# EAGLE design untitled (EAGLE 7.2.0)
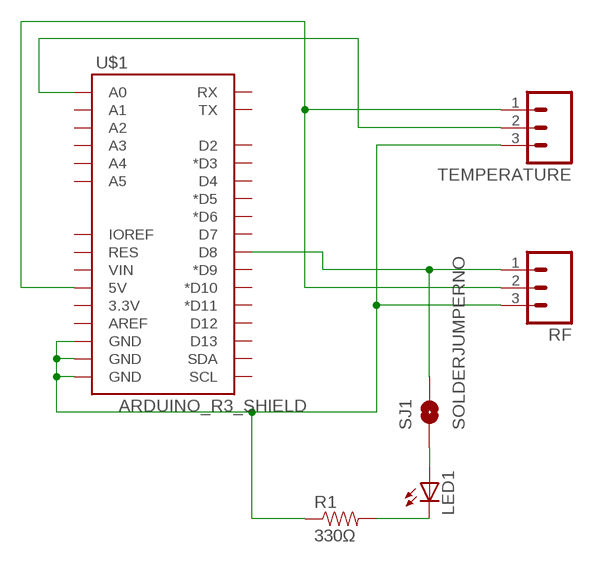
[diagram p0: schematic, sheet 1]

## Parts
LED1  LED5MM  [LED5MM]
R1  330Ω  10KOHM-1/4W-1%(PTH)HORIZ  [AXIAL-0.3]
RF  M03LONGPADS  [1X03_LONGPADS]
SJ1  SOLDERJUMPERNO  [SJ_2S-NO]
TEMPERATURE  M03LONGPADS  [1X03_LONGPADS]
U$1  ARDUINO_R3_SHIELD  [UNO_R3_SHIELD]

## Nets
N$2: LED1.A SJ1.1
N$3: R1.P$1 RF.3 TEMPERATURE.3 U$1.GND@0(GND) U$1.GND@1(GND) U$1.GND@2(GND)
N$4: RF.1 SJ1.2 U$1.D8
N$5: TEMPERATURE.2 U$1.A0
N$6: LED1.K(C) R1.P$2
N$7: RF.2 TEMPERATURE.1 U$1.5V
Unconnected: U$1.3.3V U$1.A1 U$1.A2 U$1.A3 U$1.A4 U$1.A5 U$1.AREF U$1.D2 U$1.D3(*D3) U$1.D4 U$1.D5(*D5) U$1.D6(*D6) U$1.D7 U$1.D9(*D9) U$1.D10(*D10) U$1.D11(*D11) U$1.D12 U$1.D13 U$1.IOREF U$1.RES U$1.RX U$1.SCL U$1.SDA U$1.TX U$1.VIN

## Library data of the parts
LED1 = adafruit:LED: LED OSRAM: - CHIPLED LG R971, LG N971, LY N971, LG Q971, LY Q971, LO R971, LY R971 LH N974, LH R974 LS Q976, LO Q976, LY Q976 LO Q996 - Hyper CHIPLED LW Q18S LB Q993, LB Q99A, LB R99A - SideLED LS A670, LO A670, LY A670, LG A670, LP A670 LB A673, LV A673, LT A673, LW A673 LH A674 LY A675 LS A676, LA A676, LO A676, LY A676, LW A676 LS A679, LY A679, LG A679 - Hyper Micro SIDELED® LS Y876, LA Y876, LO Y876, LY Y876 LT Y87S - SmartLED LW L88C, LW L88S LB L89C, LB L89S, LG L890 LS L89K, LO L89K, LY L89K LS L896, LA L896, LO L896, LY L896 - TOPLED LS T670, LO T670, LY T670, LG T670, LP T670 LSG T670, LSP T670, LSY T670, LOP T670, LYG T670 LG T671, LOG T671, LSG T671 LB T673, LV T673, LT T673, LW T673 LH T674 LS T676, LA T676, LO T676, LY T676, LB T676, LH T676, LSB T676, LW T676 LB T67C, LV T67C, LT T67C, LS T67K, LO T67K, LY T67K, LW E67C LS E67B, LA E67B, LO E67B, LY E67B, LB E67C, LV E67C, LT E67C LW T67C LS T679, LY T679, LG T679 LS T770, LO T770, LY T770, LG T770, LP T770 LB T773, LV T773, LT T773, LW T773 LH T774 LS E675, LA E675, LY E675, LS T675 LS T776, LA T776, LO T776, LY T776, LB T776 LHGB T686 LT T68C, LB T68C - Hyper Mini TOPLED® LB M676 - Mini TOPLED Santana® LG M470 LS M47K, LO M47K, LY M47K Source: http://www.osram.convergy.de/
R1 = SparkFun-Resistors:10KOHM-1/4W-1%(PTH): RES-12183; PROD_ID: RES-12183; VALUE: 10k
RF TEMPERATURE = SparkFun-Connectors:M03: Header 3 Standard 3-pin 0.1" header. Use with straight break away headers (SKU : PRT-00116), right angle break away headers (PRT-00553), swiss pins (PRT-00743), machine pins (PRT-00117), and female headers (PRT-00115). Molex polarized connector foot print use with SKU : PRT-08232 with associated crimp pins and housings.
SJ1 = SparkFun-Retired:SOLDERJUMPER: Solder Jumper Standard SMD solder jumper. Used to automate production. Two varients : Normally Open and Normally Closed are the same, but have different paste layers. NC will have a large amount of paste and should jumper during reflow.
U$1 = SparkFun-Boards:ARDUINO_R3_SHIELD: Shield form compatible with the Arduino Uno R3.

## Board
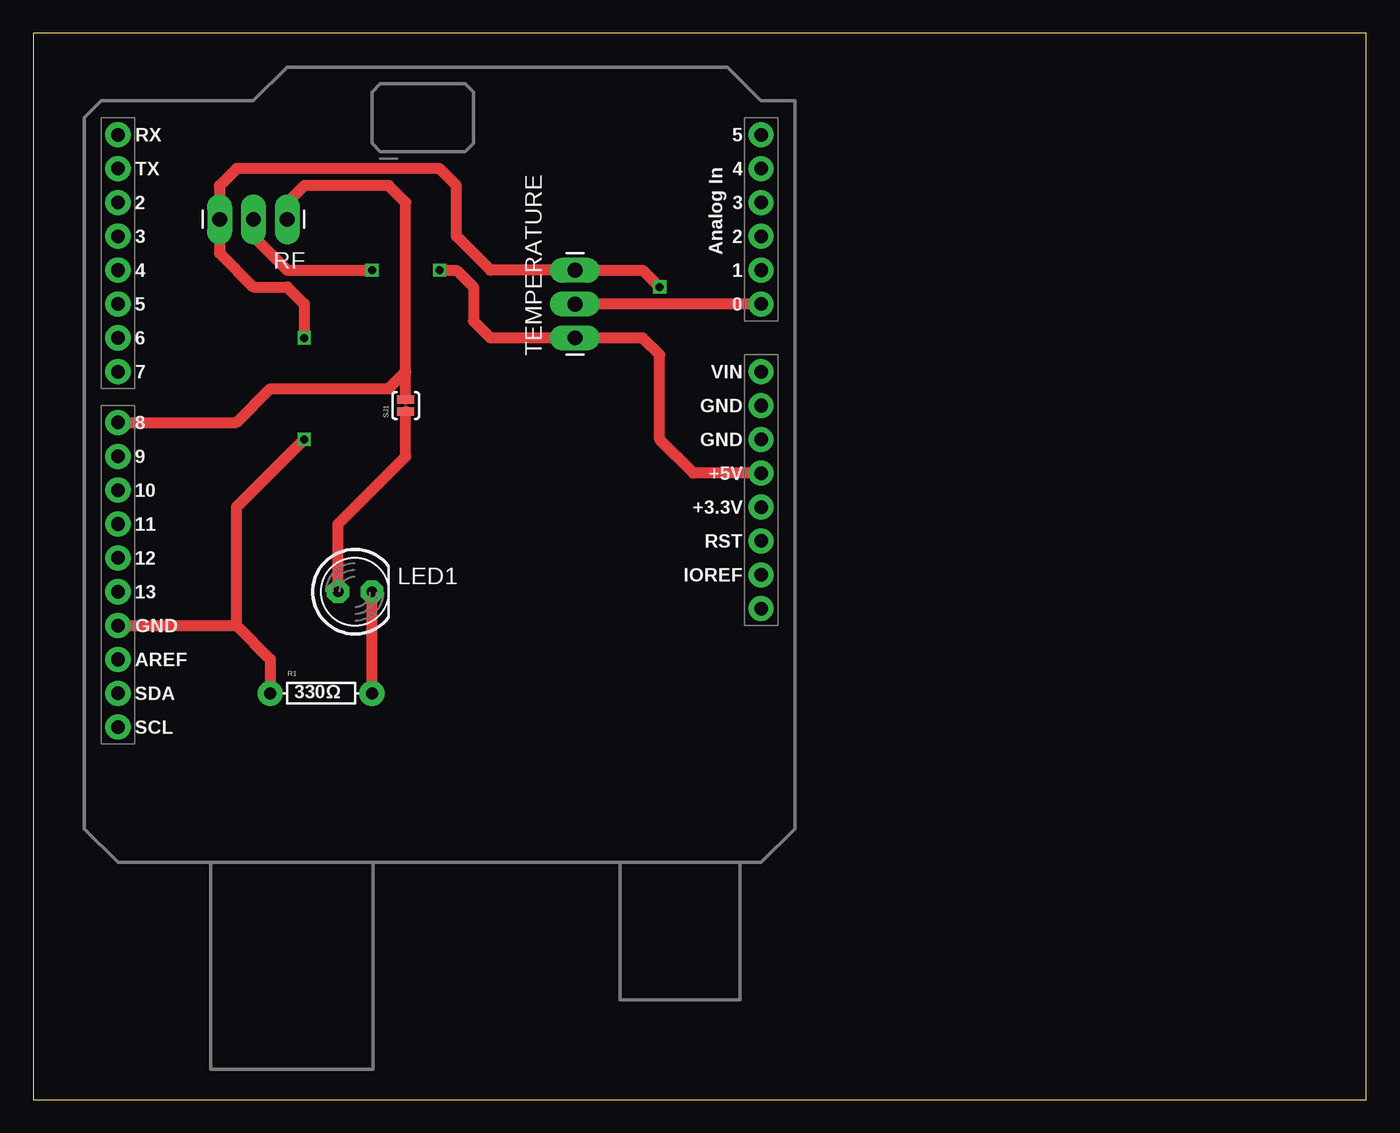
[diagram p1: board, top side]
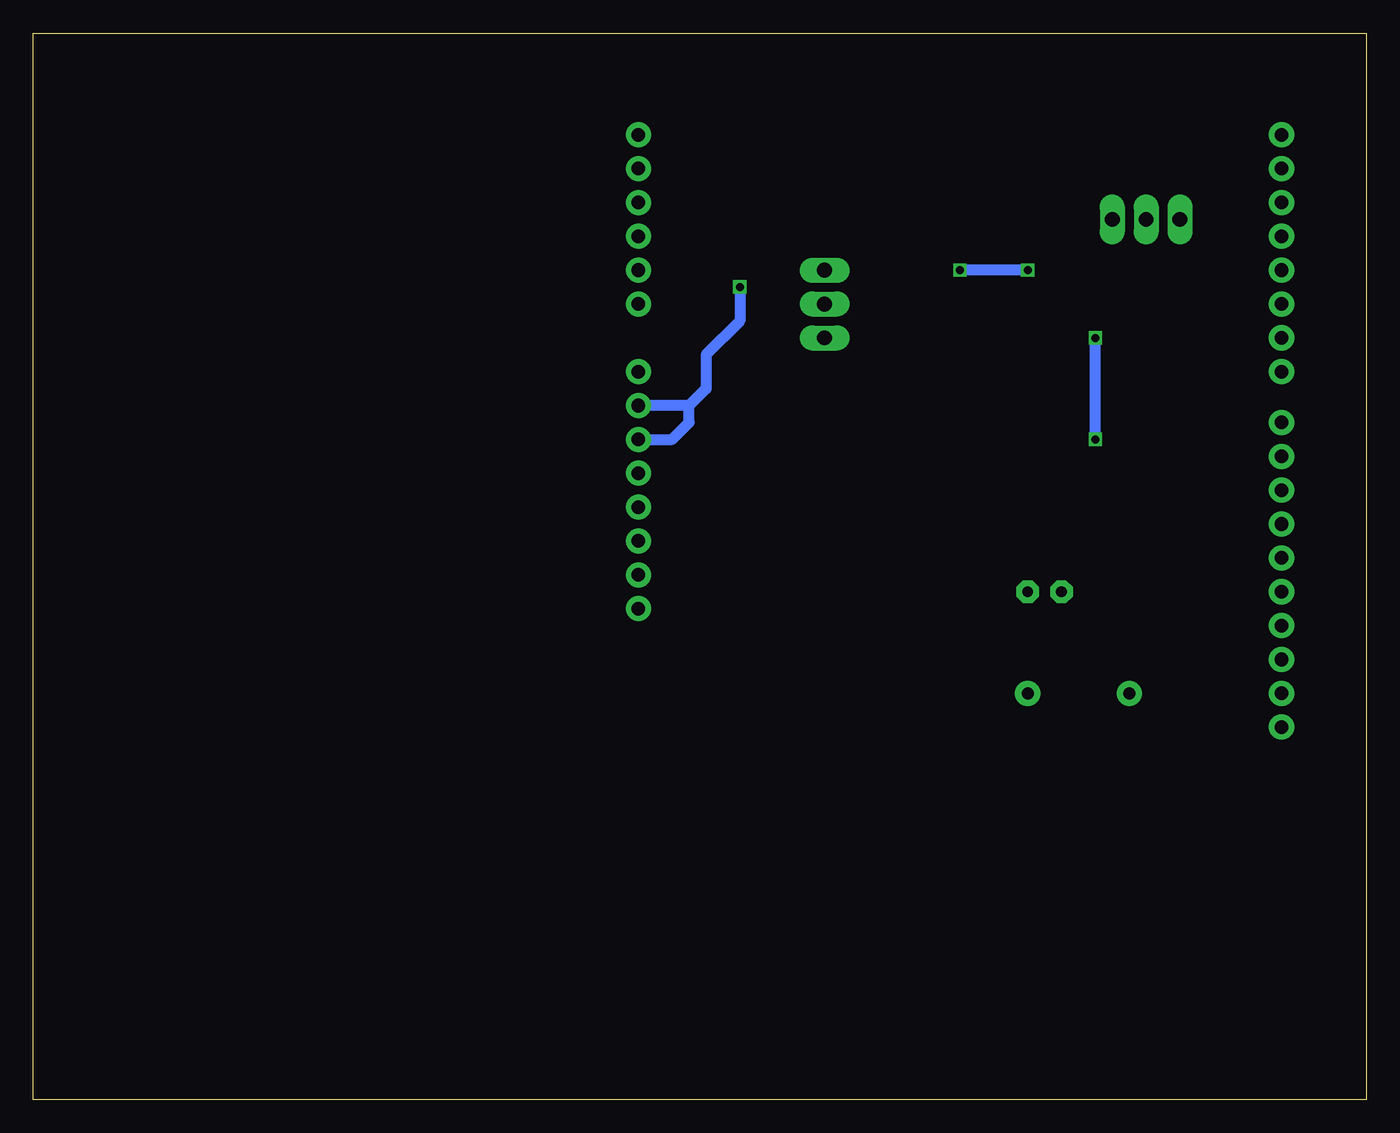
[diagram p2: board, bottom side, seen from below]

Size 100 x 80 mm. Coordinates in mm from the lower left corner, seen from the top.
Outline: 0,0 100,0 100,80 0,80 0,0
Copper layers (1*16): Top 0.035mm / dielectric 1.5mm / Bottom 0.035mm
Design rules "default": minimum track width 10mil, minimum drill 24mil, track to track 8mil, track to pad 8mil, pad to pad 8mil, via to via 8mil, smd to smd 8mil, copper to edge 40mil, drill to drill 8mil, minimum pad ring 10mil, minimum via ring 8mil, stop-mask expansion 4mil, vias tented up to drill 0mil, thermal gap 10mil

### Footprints (pad centres in the part's own frame; a part is rotated, then mirrored left to right if it is on the bottom)
LED5MM = drill 0.813 pad 1.676 octagon: A -1.27,0; K 1.27,0
AXIAL-0.3 = drill 0.9 pad 1.88: P$1 -3.81,0; P$2 3.81,0
1X03_LONGPADS = drill 1.118 pad 1.88 long: 1 0,0; 2 2.54,0; 3 5.08,0
SJ_2S-NO = smd 0.635 x 1.27: 1 -0.45,0; 2 0.45,0
UNO_R3_SHIELD = drill 1.016 pad 1.88: 3.3V 50.8,26.67; 5V 50.8,29.21; A0 50.8,41.91; A1 50.8,44.45; A2 50.8,46.99; A3 50.8,49.53; A4 50.8,52.07; A5 50.8,54.61; AREF 2.54,15.24; D2 2.54,49.53; D3 2.54,46.99; D4 2.54,44.45; D5 2.54,41.91; D6 2.54,39.37; D7 2.54,36.83; D8 2.54,33.02; D9 2.54,30.48; D10 2.54,27.94; D11 2.54,25.4; D12 2.54,22.86; D13 2.54,20.32; GND@0 50.8,31.75; GND@1 50.8,34.29; GND@2 2.54,17.78; IOREF 50.8,21.59; NC 50.8,19.05; RES 50.8,24.13; RX 2.54,54.61; SCL 2.54,10.16; SDA 2.54,12.7; TX 2.54,52.07; VIN 50.8,36.83

### Placement (x,y rotation side)
LED1  24.13,38.1 0 top
R1  21.59,30.48 0 top
RF  19.05,66.04 180 top
SJ1  27.94,52.07 90 top
TEMPERATURE  40.64,57.15 90 top
U$1  3.81,17.78 0 top

### Tracks (layer width: path | path; a pad name or v marks a point on that pad's centre or on a via)
N$2
  Top 0.813: LED1.A 22.86,43.18 27.94,48.26 SJ1.1
N$3  (via drill 0.6)
  Top 0.813: U$1.GND@2 15.24,35.56 | 15.24,35.56 17.78,33.02 R1.P$1 | v46.99,60.96 45.72,62.23 TEMPERATURE.3 34.29,62.23 31.75,64.77 31.75,68.58 30.48,69.85 15.24,69.85 13.97,68.58 RF.3 13.97,63.5 16.51,60.96 19.05,60.96 20.32,59.69 v20.32,57.15 | 15.24,35.56 15.24,44.45 v20.32,49.53
  Bottom 0.813: v46.99,60.96 46.99,58.42 49.53,55.88 49.53,53.34 50.8,52.07 | 50.8,52.07 U$1.GND@1 | U$1.GND@0 52.07,49.53 50.8,50.8 50.8,52.07 | v20.32,49.53 v20.32,57.15
N$4
  Top 0.813: SJ1.2 27.94,54.61 | U$1.D8 15.24,50.8 17.78,53.34 26.67,53.34 27.94,54.61 | 27.94,54.61 27.94,67.31 26.67,68.58 20.32,68.58 19.05,67.31 RF.1
N$5
  Top 0.813: U$1.A0 TEMPERATURE.2
N$6
  Top 0.813: R1.P$2 LED1.K
N$7  (via drill 0.6)
  Top 0.813: U$1.5V 49.53,46.99 46.99,49.53 46.99,55.88 45.72,57.15 TEMPERATURE.1 34.29,57.15 33.02,58.42 33.02,60.96 31.75,62.23 v30.48,62.23 | RF.2 16.51,64.77 19.05,62.23 v25.4,62.23
  Bottom 0.813: v25.4,62.23 v30.48,62.23